# EAGLE design Controller Board v3 (EAGLE 5.06)
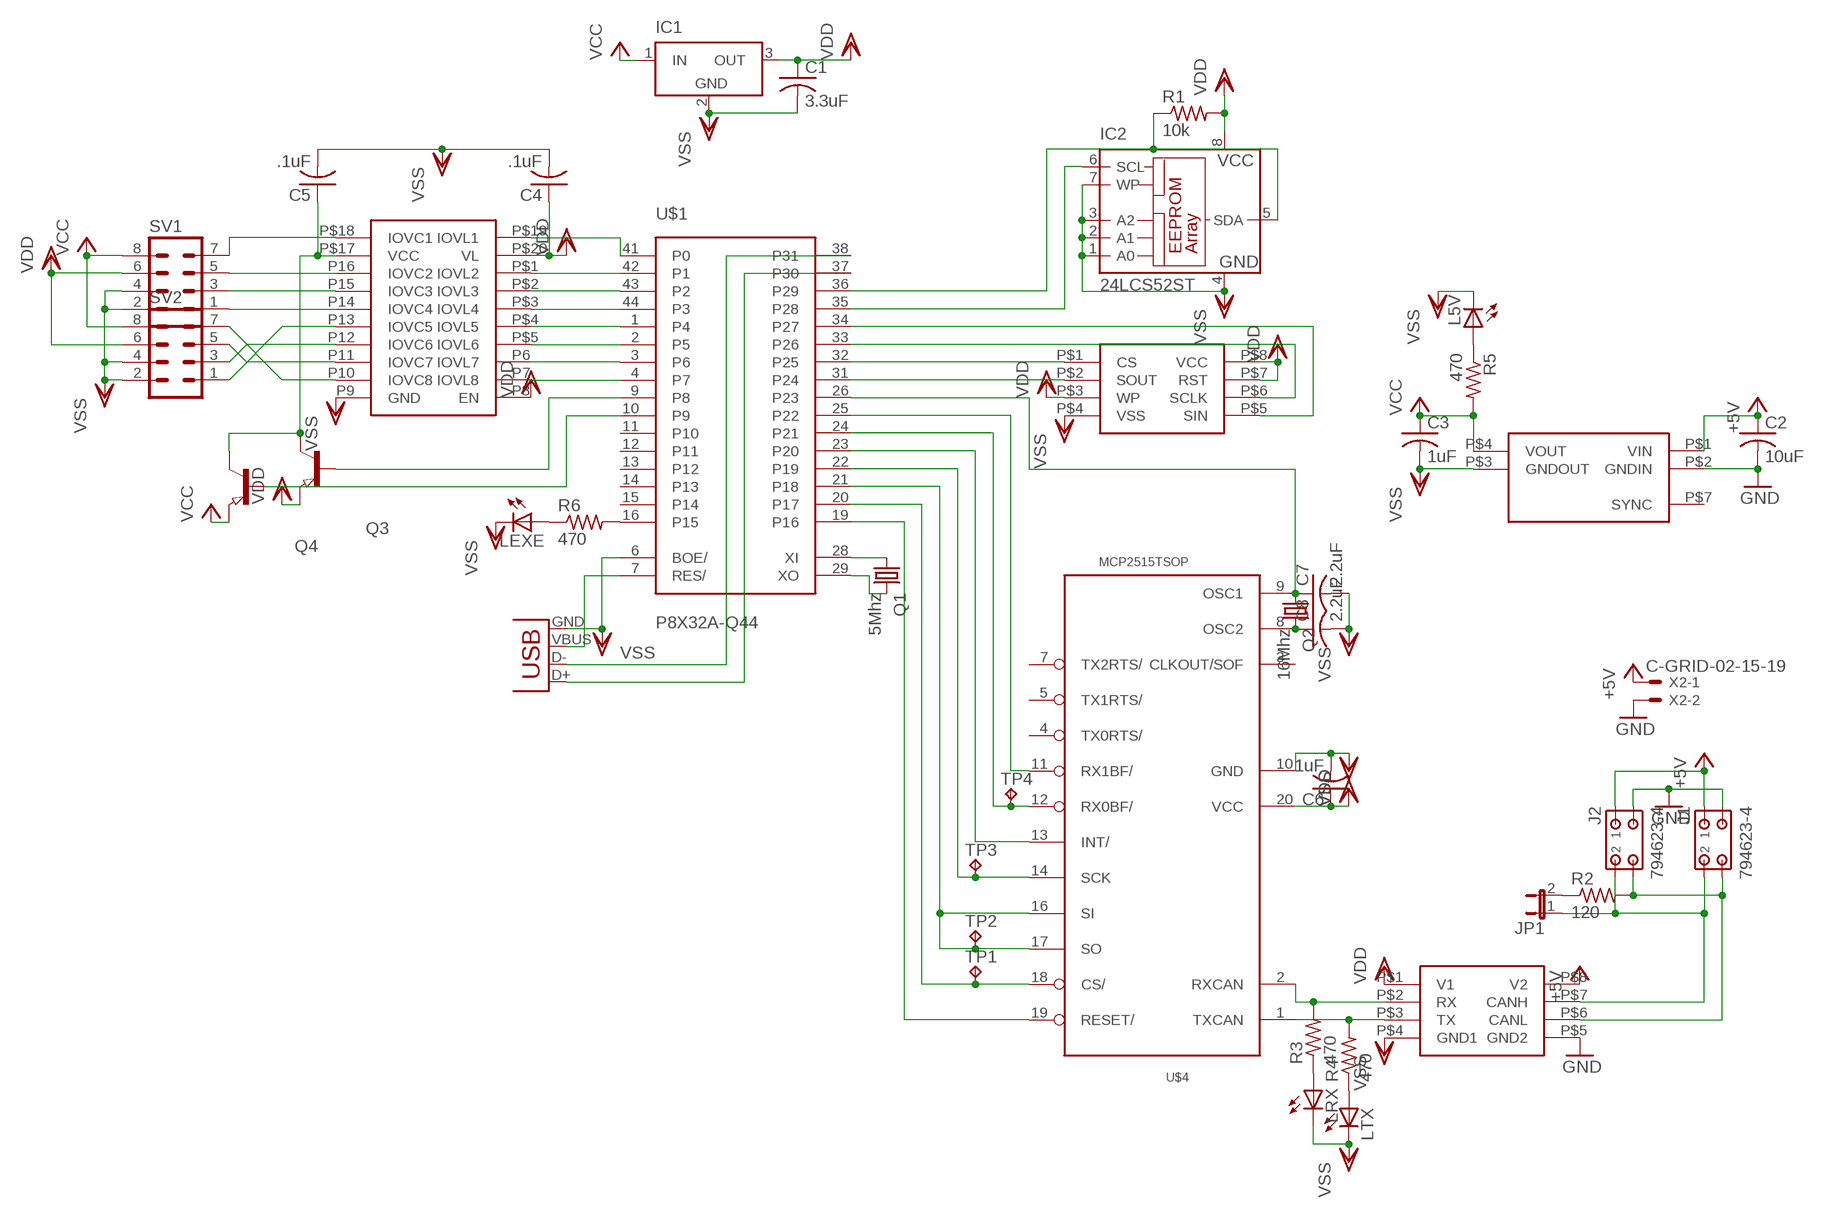
[diagram p0: schematic, sheet 1]

## Parts
C1  3.3uF  C-USC0805  [C0805]
C2  10uF  C-USC0805  [C0805]
C3  1uF  C-USC0805  [C0805]
C4  .1uF  C-USC0805  [C0805]
C5  .1uF  C-USC0805  [C0805]
C6  1uF  C-USC0805  [C0805]
C7  2.2uF  C-USC0805  [C0805]
C8  2.2uF  C-USC0805  [C0805]
IC1  LT1129CST5  [SOT223]
IC2  24LCS52ST  [TSSOP8]
J1  794623-4  [794623-4]
J2  794623-4  [794623-4]
JP1  JP1E  [JP1]
L5V  LEDCHIP-LED0805  [CHIP-LED0805]
LEXE  LEDCHIP-LED0805  [CHIP-LED0805]
LRX  LEDCHIP-LED0805  [CHIP-LED0805]
LTX  LEDCHIP-LED0805  [CHIP-LED0805]
Q1  5Mhz  CRYSTALHC49UP  [HC49UP]
Q2  16Mhz  CRYSTALHC49UP  [HC49UP]
Q3  PNP-TRANSISTOR_SOT23  [SOT23]
Q4  PNP-TRANSISTOR_SOT23  [SOT23]
R1  10k  R-US_R0603  [R0603]
R2  120  R-US_R0603  [R0603]
R3  470  R-US_R0603  [R0603]
R4  470  R-US_R0603  [R0603]
R5  470  R-US_R0603  [R0603]
R6  470  R-US_R0603  [R0603]
SV1  MA04-2  [MA04-2]
SV2  MA04-2  [MA04-2]
TP1  TPPAD1-13  [P1-13]
TP2  TPPAD1-13  [P1-13]
TP3  TPPAD1-13  [P1-13]
TP4  TPPAD1-13  [P1-13]
U$1  P8X32A-Q44  [P8X32A-Q44]
U$2  TI-DCP020505  [PDIP14-7]
U$3  TI-ISO1050  [DUB-8]
U$4  MCP2515TSOP  [TSSOP20]
U$5  M25PE20  [S08N]
U$6  MAX3000E  [TQFN-20]
X1  USBSMD  [USB-MINIB]
X2  C-GRID-02-15-19  [15-91-02]

## Nets
+5V: C2.1 J1.1 J2.1 U$2.P$1(VIN) U$3.P$8(V2) X2.1
GND: C2.2 J1.3 J2.3 U$2.P$2(GNDIN) U$3.P$5(GND2) X2.2
N$1: Q1.1 U$1.28(XI)
N$2: Q1.2 U$1.29(XO)
N$3: IC2.6(SCL) U$1.35(P28)
N$4: IC2.5(SDA) R1.1 U$1.36(P29)
N$5: U$1.7(RES/) X1.VBUS
N$6: U$1.38(P31) X1.D-
N$7: U$1.37(P30) X1.D+
N$8: U$1.25(P22) U$4.11(RX1BF/)
N$9: TP4.1(TP) U$1.24(P21) U$4.12(RX0BF/)
N$10: J1.4 J2.4 R2.2 U$3.P$6(CANL)
N$11: J1.2 J2.2 JP1.1 U$3.P$7(CANH)
N$12: U$1.33(P26) U$5.P$6(SCLK)
N$13: U$1.34(P27) U$5.P$5(SIN)
N$14: U$1.32(P25) U$5.P$1(CS)
N$15: U$1.31(P24) U$5.P$2(SOUT)
N$16: U$1.23(P20) U$4.13(INT/)
N$17: TP3.1(TP) U$1.22(P19) U$4.14(SCK)
N$18: C7.1 Q2.1 U$1.26(P23) U$4.9(OSC1)
N$19: C8.1 Q2.2 U$4.8(OSC2)
N$20: R3.2 U$3.P$2(RX) U$4.2(RXCAN)
N$21: R4.2 U$3.P$3(TX) U$4.1(TXCAN)
N$22: JP1.2 R2.1
N$23: TP2.1(TP) U$1.21(P18) U$4.16(SI) U$4.17(SO)
N$24: TP1.1(TP) U$1.20(P17) U$4.18(CS/)
N$25: U$1.19(P16) U$4.19(RESET/)
N$26: LRX.A R3.1
N$27: U$1.41(P0) U$6.P$19(IOVL1)
N$28: SV1.7 U$6.P$18(IOVC1)
N$29: SV1.5 U$6.P16(IOVC2)
N$30: U$1.42(P1) U$6.P$1(IOVL2)
N$31: U$1.43(P2) U$6.P$2(IOVL3)
N$32: U$1.44(P3) U$6.P$3(IOVL4)
N$33: U$1.1(P4) U$6.P$4(IOVL5)
N$34: U$1.2(P5) U$6.P$5(IOVL6)
N$35: U$1.3(P6) U$6.P6(IOVL7)
N$36: U$1.4(P7) U$6.P7(IOVL8)
N$37: SV1.3 U$6.P15(IOVC3)
N$38: SV1.1 U$6.P14(IOVC4)
N$39: SV2.1 U$6.P13(IOVC5)
N$40: SV2.7 U$6.P10(IOVC8)
N$41: SV2.3 U$6.P12(IOVC6)
N$42: SV2.5 U$6.P11(IOVC7)
N$43: Q3.1(B) U$1.9(P8)
N$44: Q4.1(B) U$1.10(P9)
N$45: C5.1 Q3.3(C) Q4.3(C) U$6.P$17(VCC)
N$46: LTX.A R4.1
N$47: L5V.A R5.1
N$48: LEXE.A R6.1
N$49: R6.2 U$1.16(P15)
VCC: C3.1 IC1.1(IN) Q4.2(E) R5.2 SV1.8 SV2.8 U$2.P$4(VOUT)
VDD: C1.1 C4.1 C6.1 IC1.3(OUT) IC2.8(VCC) Q3.2(E) R1.2 SV1.6 SV2.6 U$3.P$1(V1) U$4.20(VCC) U$5.P$3(WP) U$5.P$7(RST) U$5.P$8(VCC) U$6.P8(EN) U$6.P$20(VL)
VSS: C1.2 C3.2 C4.2 C5.2 C6.2 C7.2 C8.2 IC1.2(GND) IC2.1(A0) IC2.2(A1) IC2.3(A2) IC2.4(GND) IC2.7(WP) L5V.C LEXE.C LRX.C LTX.C SV1.2 SV1.4 SV2.2 SV2.4 U$1.6(BOE/) U$2.P$3(GNDOUT) U$3.P$4(GND1) U$4.10(GND) U$5.P$4(VSS) U$6.P9(GND) X1.GND
Unconnected: U$1.11(P10) U$1.12(P11) U$1.13(P12) U$1.14(P13) U$1.15(P14) U$2.P$7(SYNC) U$4.3(CLKOUT/SOF) U$4.4(TX0RTS/) U$4.5(TX1RTS/) U$4.7(TX2RTS/)

## Power pins joined to a net without a drawn wire
VDD: U$1.8(VDD) U$1.18(VDD) U$1.30(VDD) U$1.40(VDD)
VSS: IC1.4(GND) U$1.5(VSS) U$1.17(VSS) U$1.27(VSS) U$1.39(VSS)

## Library data of the parts
C1-C8 = rcl:C-US: CAPACITOR, American symbol
IC1 = linear-technology:LT1129CST5: VOLTAGE REGULATOR with shutdown
IC2 = microchip:24*: Serial EEPROM I2C
J1 J2 = con-amp:794623-4: MICRO MATE N LOK Dual Row, grid 1.5 mm Source: http://catalog.tycoelectronics.com .. ENG_CD_794623_F.pdf
JP1 = jumper:JP1E: JUMPER
L5V LEXE LRX LTX = led:LED: LED OSRAM: - CHIPLED LG R971, LG N971, LY N971, LG Q971, LY Q971, LO R971, LY R971 LH N974, LH R974 LS Q976, LO Q976, LY Q976 LO Q996 - Hyper CHIPLED LW Q18S LB Q993, LB Q99A, LB R99A - SideLED LS A670, LO A670, LY A670, LG A670, LP A670 LB A673, LV A673, LT A673, LW A673 LH A674 LY A675 LS A676, LA A676, LO A676, LY A676, LW A676 LS A679, LY A679, LG A679 - Hyper Micro SIDELED® LS Y876, LA Y876, LO Y876, LY Y876 LT Y87S - SmartLED LW L88C, LW L88S LB L89C, LB L89S, LG L890 LS L89K, LO L89K, LY L89K LS L896, LA L896, LO L896, LY L896 - TOPLED LS T670, LO T670, LY T670, LG T670, LP T670 LSG T670, LSP T670, LSY T670, LOP T670, LYG T670 LG T671, LOG T671, LSG T671 LB T673, LV T673, LT T673, LW T673 LH T674 LS T676, LA T676, LO T676, LY T676, LB T676, LH T676, LSB T676, LW T676 LB T67C, LV T67C, LT T67C, LS T67K, LO T67K, LY T67K, LW E67C LS E67B, LA E67B, LO E67B, LY E67B, LB E67C, LV E67C, LT E67C LW T67C LS T679, LY T679, LG T679 LS T770, LO T770, LY T770, LG T770, LP T770 LB T773, LV T773, LT T773, LW T773 LH T774 LS E675, LA E675, LY E675, LS T675 LS T776, LA T776, LO T776, LY T776, LB T776 LHGB T686 LT T68C, LB T68C - Hyper Mini TOPLED® LB M676 - Mini TOPLED Santana® LG M470 LS M47K, LO M47K, LY M47K Source: http://www.osram.convergy.de LUXEON: - LUMILED® LXK2-PW12-R00, LXK2-PW12-S00, LXK2-PW14-U00, LXK2-PW14-V00 LXK2-PM12-R00, LXK2-PM12-S00, LXK2-PM14-U00 LXK2-PE12-Q00, LXK2-PE12-R00, LXK2-PE12-S00, LXK2-PE14-T00, LXK2-PE14-U00 LXK2-PB12-K00, LXK2-PB12-L00, LXK2-PB12-M00, LXK2-PB14-N00, LXK2-PB14-P00, LXK2-PB14-Q00 LXK2-PR12-L00, LXK2-PR12-M00, LXK2-PR14-Q00, LXK2-PR14-R00 LXK2-PD12-Q00, LXK2-PD12-R00, LXK2-PD12-S00 LXK2-PH12-R00, LXK2-PH12-S00 LXK2-PL12-P00, LXK2-PL12-Q00, LXK2-PL12-R00 Source: www.luxeon.com KINGBRIGHT: KA-3528ASYC Source: www.kingbright.com
Q1 Q2 = crystal:CRYSTAL: CRYSTAL
Q3 Q4 = semicon-smd-ipc:PNP-TRANSISTOR_: PNP TRANSISTOR
R1-R6 = rcl:R-US_: RESISTOR, American symbol
SV1 SV2 = con-lstb:MA04-2: PIN HEADER
TP1-TP4 = testpad:TP: Test pad
U$1 = parallax_propeller:P8X32A-Q44
U$2 = isodcdc:TI-DCP020505
U$3 = isodcdc:TI-ISO1050
U$4 = MCP2515_MT:MCP2515*: MCP2515 Standalone CAN-Controller by Microchip Eagle-Lib. by MartinThomas
U$5 = Flash:M25PE20
U$6 = Level Shifters:MAX3000E
X1 = SparkFun:USB: USB Connectors USB-B-PTH is fully proven SKU : PRT-00139 USB-miniB is fully proven SKU : PRT-00587 USB-A-PCB is untested. USB-A-H is throughly reviewed, but untested. Spark Fun Electronics SKU : PRT-00437 USB-B-SMT is throughly reviewed, but untested. Needs silkscreen touching up. USB-A-S has not been used/tested USB-MB-H has not been used/tested
X2 = con-molex:C-GRID-02: CONNECTOR wire to board 2.54 mm (0.100") pitch header

## Board
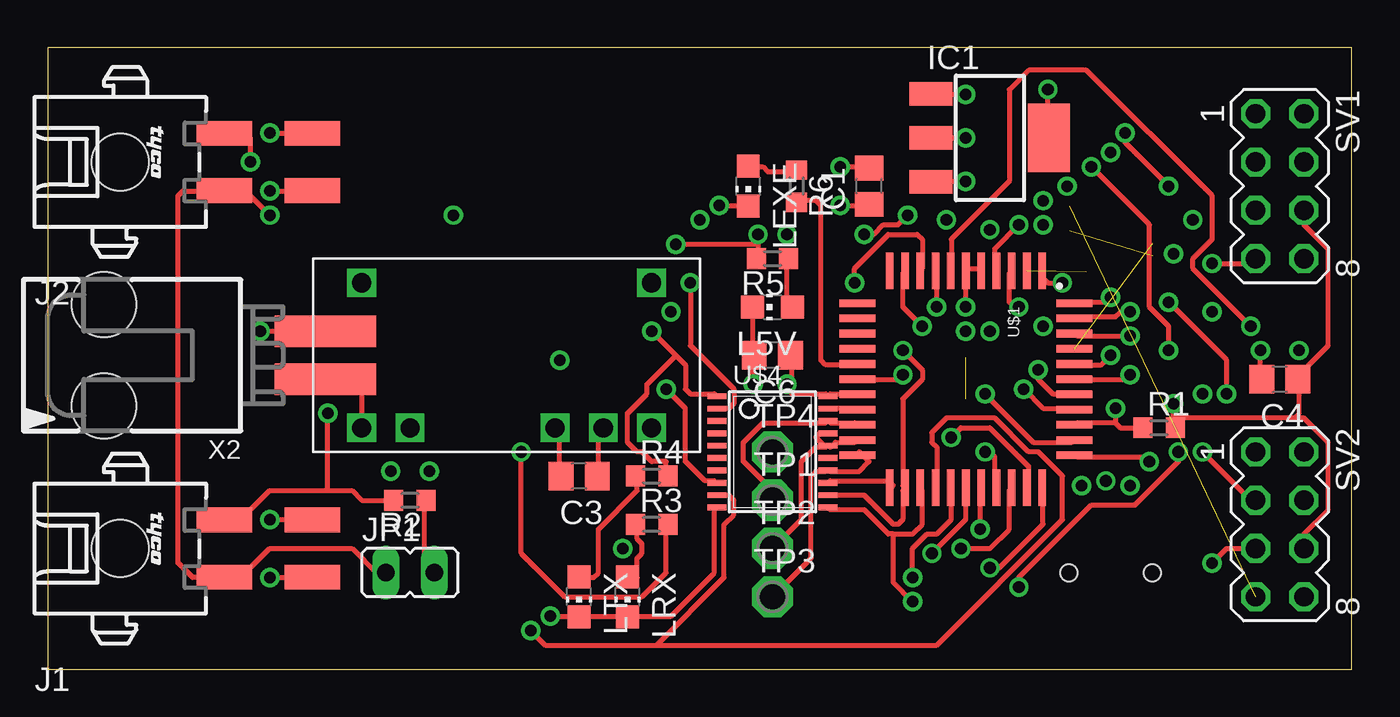
[diagram p1: board, top side]
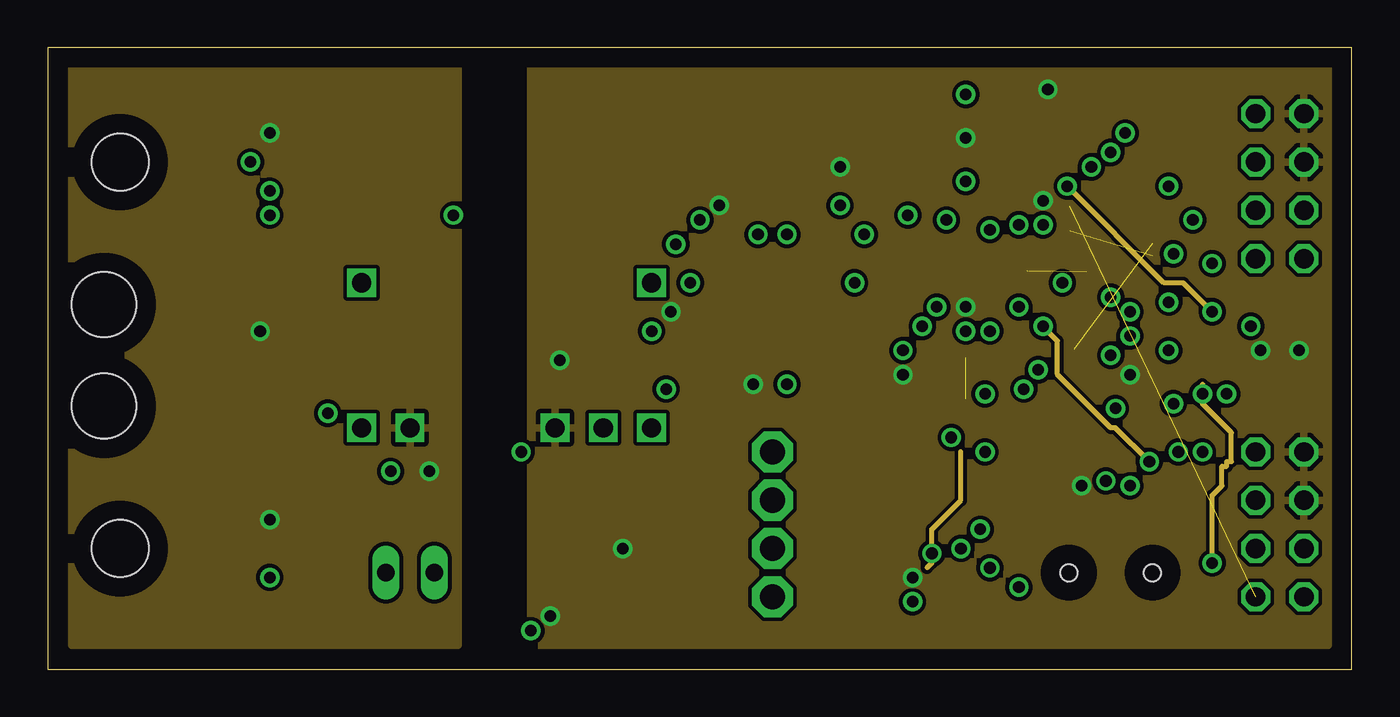
[diagram p2: board, inner layer Route2]
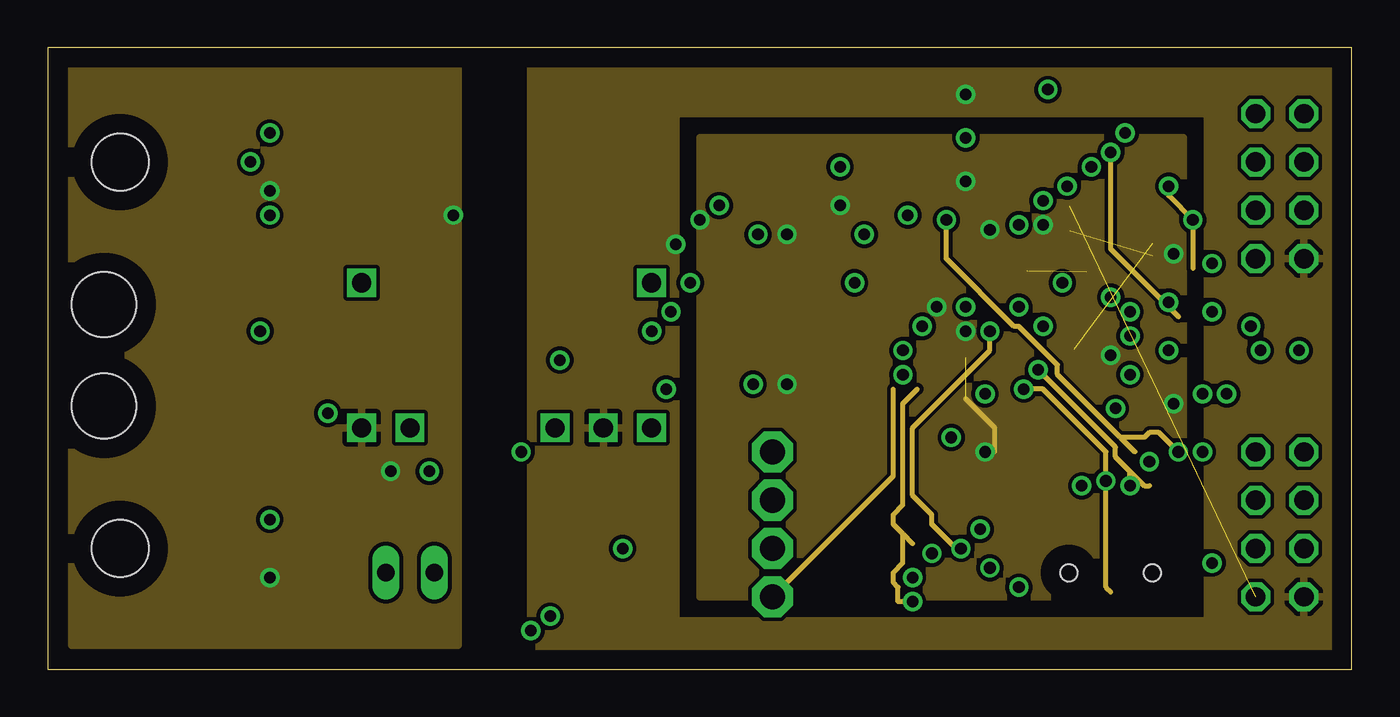
[diagram p3: board, inner layer Route15]
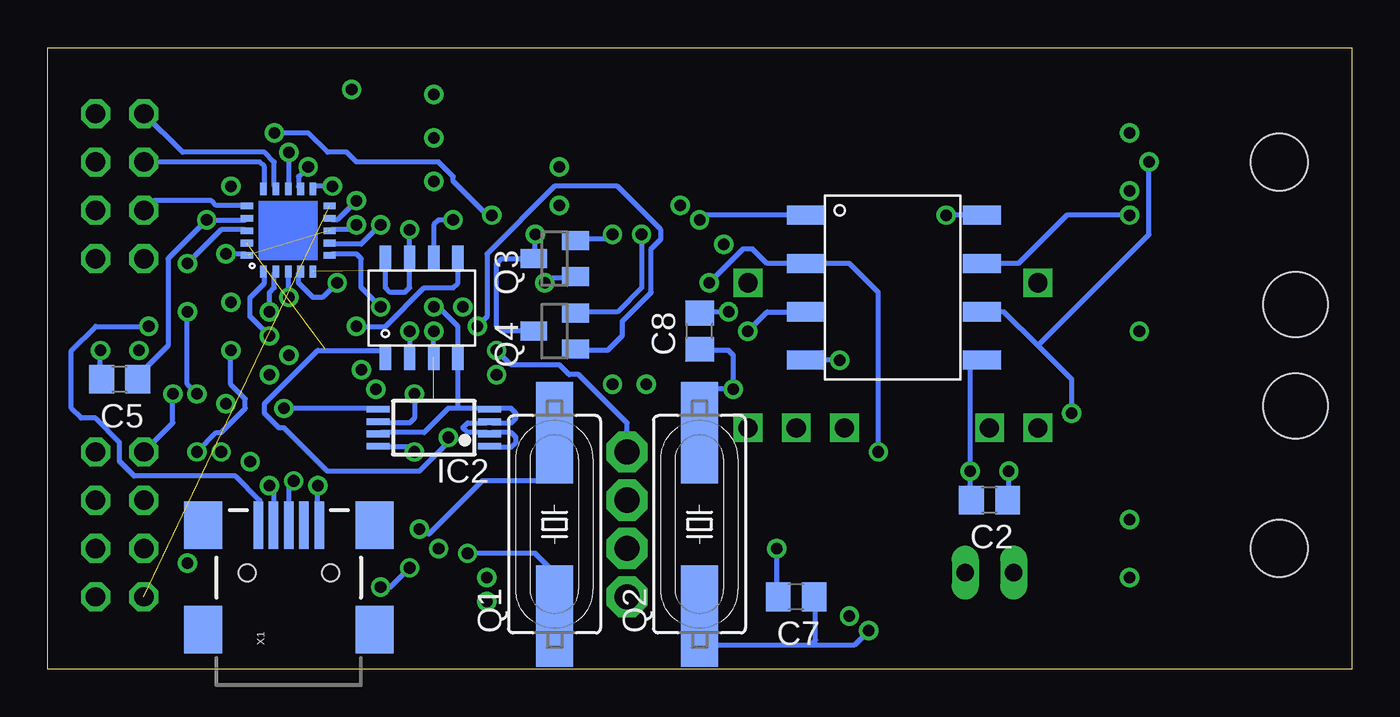
[diagram p4: board, bottom side, seen from below]

Size 68.56 x 32.69 mm. Coordinates in mm from the lower left corner, seen from the top.
Outline: 0,0 68.56,0 68.56,32.69 0,32.69 0,0
Copper layers (1*2+15*16): Top 0.035mm / dielectric 0.2mm / Route2 0.035mm / dielectric 1.5mm / Route15 0.035mm / dielectric 0.2mm / Bottom 0.035mm
Design rules "4 layer": minimum track width 10mil, minimum drill 24mil, track to track 8mil, track to pad 8mil, pad to pad 8mil, via to via 8mil, smd to smd 8mil, copper to edge 40mil, drill to drill 8mil, minimum pad ring 10mil, minimum via ring 8mil, stop-mask expansion 4mil, vias tented up to drill 0mil, thermal gap 10mil
tRestrict: area 22.9,3.8 to 24.1,30.5

### Footprints (pad centres in the part's own frame; a part is rotated, then mirrored left to right if it is on the bottom)
C0805 = smd 1.3 x 1.5: 1 -0.95,0; 2 0.95,0
SOT223 = smd 1.219 x 2.235: 1 -2.311,-3.099; 2 0,-3.099; 3 2.311,-3.099 | smd 3.6 x 2.2: 4 0,3.099
TSSOP8 = smd 0.35 x 1.2: 1 -0.975,-2.925; 2 -0.325,-2.925; 3 0.325,-2.925; 4 0.975,-2.925; 5 0.975,2.925; 6 0.325,2.925; 7 -0.325,2.925; 8 -0.975,2.925
794623-4 = smd 1.3 x 2.92: 1 1.5,10.1; 2 1.5,5.48; 3 -1.5,10.1; 4 -1.5,5.48 | hole 3: 0,0
JP1 = drill 0.914 long: 1 0,-1.27; 2 0,1.27
CHIP-LED0805 = smd 1.2 x 1.2: A 0,-1.05; C 0,1.05
HC49UP = smd 5.334 x 1.93: 1 -4.826,0; 2 4.826,0
SOT23 = smd 1 x 1.4: 1 -0.95,-1.1; 2 0.95,-1.1; 3 0,1.1
R0603 = smd 1 x 1.1: 1 -0.85,0; 2 0.85,0
MA04-2 = drill 1.016 octagon: 1 -3.81,-1.27; 2 -3.81,1.27; 3 -1.27,-1.27; 4 -1.27,1.27; 5 1.27,-1.27; 6 1.27,1.27; 7 3.81,-1.27; 8 3.81,1.27
P1-13 = drill 1.321 pad 2.159 octagon: 1 0,0
P8X32A-Q44 = smd 1.9 x 0.4: 1 -5.713,4.013; 2 -5.713,3.212; 3 -5.713,2.413; 4 -5.713,1.613; 5 -5.713,0.812; 6 -5.713,0.013; 7 -5.713,-0.787; 8 -5.713,-1.587; 9 -5.713,-2.388; 10 -5.713,-3.188; 11 -5.713,-3.987; 23 5.688,-3.987; 24 5.688,-3.188; 25 5.688,-2.388; 26 5.688,-1.587; 27 5.688,-0.787; 28 5.688,0.013; 29 5.688,0.812; 30 5.688,1.613; 31 5.688,2.413; 32 5.688,3.212; 33 5.688,4.013 | smd 0.4 x 1.9: 12 -4.013,-5.688; 13 -3.212,-5.688; 14 -2.413,-5.688; 15 -1.613,-5.688; 16 -0.812,-5.688; 17 -0.013,-5.688; 18 0.787,-5.688; 19 1.587,-5.688; 20 2.388,-5.688; 21 3.188,-5.688; 22 3.987,-5.688; 34 3.987,5.713; 35 3.188,5.713; 36 2.388,5.713; 37 1.587,5.713; 38 0.787,5.713; 39 -0.013,5.713; 40 -0.812,5.713; 41 -1.613,5.713; 42 -2.413,5.713; 43 -3.212,5.713; 44 -4.013,5.713
PDIP14-7 = drill 1 square: P$1 -8.89,-3.81; P$2 -6.35,-3.81; P$3 1.27,-3.81; P$4 3.81,-3.81; P$5 6.35,-3.81; P$6 6.35,3.81; P$7 -8.89,3.81
DUB-8 = smd 2 x 1: P$1 -4.572,3.556; P$2 -4.572,1.016; P$3 -4.572,-1.524; P$4 -4.572,-4.064; P$5 4.678,-4.064; P$6 4.678,-1.524; P$7 4.678,1.016; P$8 4.678,3.556
TSSOP20 = smd 0.305 x 0.991: 1 -2.925,-2.918; 2 -2.275,-2.918; 3 -1.625,-2.918; 4 -0.975,-2.918; 5 -0.325,-2.918; 6 0.325,-2.918; 7 0.975,-2.918; 8 1.625,-2.918; 9 2.275,-2.918; 10 2.925,-2.918; 11 2.925,2.918; 12 2.275,2.918; 13 1.625,2.918; 14 0.975,2.918; 15 0.325,2.918; 16 -0.325,2.918; 17 -0.975,2.918; 18 -1.625,2.918; 19 -2.275,2.918; 20 -2.925,2.918
S08N = smd 0.6 x 1.3: P$1 -2.54,-2.667; P$2 -1.27,-2.667; P$3 0,-2.667; P$4 1.27,-2.667; P$5 1.27,2.587; P$6 0,2.587; P$7 -1.27,2.587; P$8 -2.54,2.587
TQFN-20 = smd 0.65 x 0.35: P6 0.875,-1.1; P7 0.875,-0.45; P8 0.875,0.2; P9 0.875,0.85; P10 0.875,1.5; P16 -3.475,1.5; P$17 -3.475,0.85; P$18 -3.475,0.2; P$19 -3.475,-0.45; P$20 -3.475,-1.1 | smd 0.35 x 0.65: P11 0,2.4; P12 -0.65,2.4; P13 -1.3,2.4; P14 -1.95,2.4; P15 -2.6,2.4; P$1 -2.6,-1.95; P$2 -1.95,-1.95; P$3 -1.3,-1.95; P$4 -0.65,-1.95; P$5 0,-1.95
USB-MINIB = smd 2.5 x 0.5: D+ 2.5,0; D- 2.5,0.8; GND 2.5,-1.6; ID 2.5,-0.8; VBUS 2.5,1.6 | smd 2.5 x 2: GND@1 -3,-4.5; GND@2 -3,4.5; GND@3 2.5,4.5; GND@4 2.5,-4.5 | hole 0.9: 0,2.2; 0,-2.2
15-91-02 = smd 1.651 x 5.334: 1 -1.27,-10.795; 2 1.27,-10.795 | hole 3.404: -2.667,0.838; 2.667,0.838

### Placement (x,y rotation side)
C1  43.18,25.4 90 top
C2  19.05,8.89 180 bottom
C3  27.94,10.16 180 top
C4  64.77,15.24 180 top
C5  64.77,15.24 180 bottom
C6  38.1,16.51 180 top
C7  29.21,3.81 180 bottom
C8  34.29,17.78 90 bottom
IC1  49.53,27.94 270 top
IC2  48.26,12.7 90 bottom
J1  3.81,6.35 270 top
J2  3.81,26.67 270 top
JP1  19.05,5.08 270 top
L5V  38.1,19.05 90 top
LEXE  36.83,25.4 180 top
LRX  30.48,3.81 180 top
LTX  27.94,3.81 180 top
Q1  41.91,7.62 90 bottom
Q2  34.29,7.62 90 bottom
Q3  41.91,21.59 90 bottom
Q4  41.91,17.78 90 bottom
R1  58.42,12.7 0 top
R2  19.05,8.89 180 top
R3  31.75,7.62 0 top
R4  31.75,10.16 0 top
R5  38.1,21.59 180 top
R6  39.37,25.4 270 top
SV1  64.77,25.4 270 top
SV2  64.77,7.62 270 top
TP1  38.1,8.89 0 top
TP2  38.1,6.35 0 top
TP3  38.1,3.81 0 top
TP4  38.1,11.43 0 top
U$1  48.26,15.24 270 top
U$2  25.4,16.51 0 top
U$3  24.13,20.32 0 bottom
U$4  38.1,11.43 270 top
U$5  48.26,19.05 0 bottom
U$6  54.61,22.86 0 bottom
X1  55.88,5.08 90 bottom
X2  3.81,16.51 90 top

### Tracks (layer width: path | path; a pad name or v marks a point on that pad's centre or on a via)
+5V  (via drill 0.61)
  Top 0.254: v11.68,4.83 13.72,4.83 J1.1 | v11.68,25.15 13.72,25.15 J2.1 | U$2.P$1 16.51,14.99 16.26,15.24 X2.1
  Bottom 0.254: v18.03,10.41 18.03,8.89 C2.1 | U$3.P$8 v21.34,23.88
  pour Route15: 1.27,31.75 1.27,1.27 21.59,1.27 21.59,31.75
GND  (via drill 0.61)
  Top 0.254: v11.68,7.87 13.72,7.87 J1.3 | v11.68,28.19 13.72,28.19 J2.3 | v11.18,17.78 X2.2
  Bottom 0.254: C2.2 20.07,8.89 v20.07,10.41 20.07,16.26 U$3.P$5
  pour Route2: 21.59,31.75 21.59,1.27 1.27,1.27 1.27,31.75
N$1  (via drill 0.61)
  Top 0.254: v46.48,6.1 48.26,7.87 48.26,9.4 U$1.28
  Route2 0.254: 48.01,11.43 48.01,8.89 46.48,7.37 v46.48,6.1 46.48,5.59 46.23,5.33
  Bottom 0.254: v46.48,6.1 42.93,6.1 41.91,5.08 Q1.1
N$2  (via drill 0.61)
  Top 0.254: v49.02,7.37 49.02,9.4 U$1.29
  Bottom 0.254: v49.02,7.37 48.77,7.11 48.51,7.11 45.72,9.91 42.16,9.91 41.91,10.16 Q1.2
N$3  (via drill 0.61)
  Top 0.254: v49.28,14.48 51.82,11.94 53.85,11.94 U$1.35
  Bottom 0.254: v49.28,14.48 49.28,13.21 49.53,12.95 51.05,12.95 IC2.6
N$4  (via drill 0.61)
  Top 0.254: 56.13,12.95 56.39,12.7 R1.1 | 56.13,12.95 54.1,12.95 U$1.36 | v56.13,13.72 56.13,12.95
  Bottom 0.254: v56.13,13.72 51.31,13.72 IC2.5
N$5  (via drill 0.61)
  Top 0.254: v63.25,18.03 60.2,21.08 60.2,21.59 61.21,22.61 61.21,24.89 54.61,31.5 51.56,31.5 50.55,30.48 50.55,25.65 47.5,22.61 47.5,21.08 U$1.7
  Bottom 0.254: v63.25,18.03 66.04,18.03 67.31,16.76 67.31,13.72 66.8,13.21 66.04,13.21 64.77,11.94 64.77,10.92 64.01,10.16 58.67,10.16 57.4,8.89 57.4,7.62 X1.VBUS
N$6  (via drill 0.61)
  Top 0.254: v52.07,15.75 52.07,15.24 52.83,14.48 53.85,14.48 U$1.38
  Route15 0.254: v52.07,15.75 56.13,11.68 56.13,11.18 56.9,10.41 | 56.9,10.41 57.66,9.65 57.91,9.65 | v56.9,9.65 56.9,10.41
  Bottom 0.254: v56.9,9.65 56.64,9.4 56.64,7.62 X1.D-
N$7  (via drill 0.61)
  Top 0.254: v51.31,14.73 52.32,13.72 53.85,13.72 U$1.37
  Route15 0.254: v51.31,14.73 52.32,14.73 55.63,11.43 v55.63,9.91 55.63,4.32 55.88,4.06
  Bottom 0.254: v55.63,9.91 55.88,9.65 X1.D+
N$8  (via drill 0.61)
  Top 0.254: 44.45,7.11 44.2,7.11 42.93,8.38 41.15,8.38 U$4.11 | 44.45,7.11 45.47,7.11 45.97,7.62 45.97,9.4 U$1.25 | v45.47,3.56 44.45,4.57 44.45,7.11
  Route15 0.254: 45.72,14.73 44.96,13.97 44.96,8.64 44.45,8.13 44.45,7.62 44.96,7.11 | 44.96,7.11 45.47,6.6 | 44.96,7.11 44.96,5.59 44.45,5.08 44.45,4.57 44.7,4.32 44.7,3.56 v45.47,3.56
N$9  (via drill 0.61)
  Top 0.254: U$4.12 41.15,9.14 42.93,9.14 44.45,7.62 44.7,7.62 44.96,7.87 44.96,9.4 U$1.24 44.96,9.65 44.96,14.22 45.97,15.24 45.97,15.75 v44.96,16.76
  Bottom 0.254: v44.96,16.76 44.2,16 41.66,16 41.15,15.49 40.64,15.49 38.1,12.95 TP4.1
N$10  (via drill 0.61)
  Top 0.254: 14.73,9.4 11.68,9.4 10.16,7.87 9.4,7.87 J1.4 | 14.73,9.4 16,9.4 16.51,8.89 R2.2 | 14.73,9.4 v14.73,13.46 | v10.67,26.67 10.67,27.94 10.41,28.19 9.4,28.19 J2.4
  Bottom 0.254: 16.51,17.02 14.73,15.24 v14.73,13.46 | 16.51,17.02 18.29,18.8 U$3.P$6 | v10.67,26.67 10.67,22.86 16.51,17.02
N$11  (via drill 0.61)
  Top 0.254: JP1.1 17.27,5.08 16,6.35 11.68,6.35 10.16,4.83 9.4,4.83 J1.2 9.14,4.83 7.62,4.83 6.86,5.59 6.86,24.89 7.11,25.15 9.14,25.15 J2.2 9.4,25.15 10.41,25.15 v11.68,23.88
  Bottom 0.254: v11.68,23.88 14.99,23.88 17.53,21.34 U$3.P$7
N$12  (via drill 0.61)
  Top 0.254: v49.53,5.33 50.04,5.33 52.32,7.62 52.32,9.4 U$1.33 | v51.05,4.32 51.05,4.83 54.86,8.64 57.15,8.64 59.44,10.92 v59.44,11.43
  Route15 0.254: 56.39,12.19 53.09,15.49 53.09,16 51.05,18.03 50.8,18.03 47.24,21.59 v47.24,23.62 47.24,23.88 | 56.39,12.19 57.15,11.43 | v59.44,11.43 59.44,11.68 59.18,11.68 58.42,12.45 57.91,12.45 57.66,12.19 56.39,12.19
  Bottom 0.254: v47.24,23.62 48.01,23.62 48.26,23.37 U$5.P$6 | v49.53,5.33 50.55,4.32 v51.05,4.32
N$13  (via drill 0.61)
  Top 0.254: v57.91,10.92 57.66,11.18 54.1,11.18 U$1.34
  Route2 0.254: v57.91,10.92 56.13,12.7 55.88,12.7 53.09,15.49 53.09,17.27 v52.32,18.03
  Bottom 0.254: v52.32,18.03 50.8,18.03 48.77,20.07 47.24,20.07 46.99,20.32 U$5.P$5
N$14  (via drill 0.61)
  Top 0.254: v47.5,12.19 48.01,12.7 49.53,12.7 51.56,10.67 51.56,9.65 U$1.32
  Bottom 0.254: v47.5,12.19 47.5,11.94 49.02,10.41 53.85,10.41 56.13,12.7 56.39,12.7 57.15,13.46 57.15,13.97 54.36,16.76 50.8,16.76 U$5.P$1
N$15  (via drill 0.61)
  Top 0.254: v48.01,6.35 49.53,6.35 50.55,7.37 50.55,9.4 U$1.31
  Route15 0.254: v49.53,17.78 49.53,16.76 45.47,12.7 45.47,9.14 46.48,8.13 46.48,7.62 47.75,6.35 v48.01,6.35
  Bottom 0.254: v49.53,17.78 U$5.P$2
N$16
  Top 0.254: U$4.13 41.15,9.91 44.2,9.91 44.45,9.65 U$1.23
N$17
  Top 0.254: U$1.22 42.67,11.43 43.18,10.92 42.67,10.41 41.15,10.41 U$4.14 40.89,10.41 40.39,10.41 40.13,10.16 40.13,5.84 TP3.1
  Route15 0.254: 44.45,14.73 44.45,10.16 TP3.1
N$18  (via drill 0.61)
  Top 0.254: 32,1.27 35.56,4.83 35.56,7.62 36.07,8.13 36.07,8.89 35.81,9.14 35.31,9.14 U$4.9 | 32,1.27 26.16,1.27 v25.4,2.03 | 32,1.27 46.74,1.27 53.34,7.87 53.34,10.16 52.07,11.43 51.56,11.43 49.78,13.21 47.24,13.21 46.48,12.45 46.48,11.94 46.74,11.68 46.74,9.65 U$1.26
  Bottom 0.254: 28.45,1.27 28.19,1.52 28.19,3.81 C7.1 | 28.45,1.27 34.29,1.27 Q2.1 | v25.4,2.03 26.16,1.27 28.45,1.27
N$19  (via drill 0.61)
  Top 0.254: v32.51,14.73 33.53,13.72 33.53,10.92 34.54,9.91 35.05,9.91 U$4.8
  Bottom 0.254: Q2.2 34.29,14.48 34.04,14.73 v32.51,14.73 32.51,16.51 32.77,16.76 34.29,16.76 C8.1
N$20  (via drill 0.61)
  Top 0.254: v33.78,20.32 33.78,17.02 36.07,14.73 36.07,13.97 35.81,13.72 35.31,13.72 U$4.2 | v24.89,11.43 24.89,6.1 27.18,3.81 31.24,3.81 32.51,5.08 32.51,7.62 R3.2
  Bottom 0.254: v33.78,20.32 32,22.1 31.5,22.1 30.73,21.34 U$3.P$2 26.42,21.34 24.89,19.81 v24.89,11.43
N$21  (via drill 0.61)
  Top 0.254: 33.02,16.51 v31.75,17.78 | 33.02,16.51 33.53,16 33.53,14.73 33.78,14.48 35.05,14.48 U$4.1 | 33.02,16.51 31.5,14.99 31.5,14.48 30.48,13.46 30.48,11.94 30.99,11.43 31.24,11.43 31.75,10.92 32.51,10.92 32.51,10.16 R4.2
  Bottom 0.254: v31.75,17.78 30.73,18.8 U$3.P$3
N$22
  Top 0.254: JP1.2 19.81,5.59 19.81,8.89 R2.1
N$23
  Top 0.254: 40.89,11.68 40.39,12.19 40.64,12.45 40.89,12.45 U$4.17 | U$1.21 42.42,11.94 41.4,11.94 41.15,11.68 U$4.16 40.89,11.68 | 40.89,11.68 40.39,11.68 39.62,10.92 39.62,7.87 TP2.1
N$24
  Top 0.254: U$1.20 42.42,12.95 41.15,12.95 U$4.18 40.89,12.95 37.59,12.95 36.58,11.94 36.58,10.92 38.1,9.4 TP1.1
N$25
  Top 0.254: U$4.19 41.15,13.72 42.42,13.72 U$1.19
N$26
  Top 0.254: R3.1 30.99,7.62 30.99,6.86 31.24,6.6 31.24,6.1 30.99,5.84 30.99,4.83 30.48,4.83 LRX.A
N$27  (1 unrouted)
N$28  (via drill 0.61)
  Top 0.254: v61.21,21.34 63.25,21.34 SV1.7
  Bottom 0.254: v61.21,21.34 59.44,23.11 58.17,23.11 U$6.P$18
N$29
  Bottom 0.254: SV1.5 62.99,24.64 59.94,24.64 59.69,24.38 58.17,24.38 U$6.P16
N$30  (via drill 0.61)
  Top 0.254: v56.9,17.53 54.1,17.53 U$1.42
  Bottom 0.254: v56.9,17.53 57.91,18.54 57.91,19.56 57.15,20.32 57.15,20.83 U$6.P$1
N$31  (via drill 0.61)
  Top 0.254: v56.9,18.8 56.39,18.8 56.13,18.54 54.1,18.54 U$1.43
  Bottom 0.254: v56.9,18.8 56.9,19.81 56.64,20.07 56.64,20.83 U$6.P$2
N$32  (via drill 0.61)
  Top 0.254: v55.88,19.56 55.63,19.3 54.1,19.3 U$1.44
  Bottom 0.254: v55.88,19.56 55.88,20.83 U$6.P$3
N$33  (via drill 0.61)
  Top 0.254: v53.34,20.32 52.58,20.32 52.32,20.57 52.32,20.83 U$1.1
  Bottom 0.254: v53.34,20.32 54.1,19.56 54.61,19.56 55.37,20.32 55.37,20.83 U$6.P$4
N$34  (1 unrouted)
N$35  (via drill 0.61)
  Top 0.254: v51.05,19.05 50.8,19.05 50.55,19.3 50.55,20.83 U$1.3
  Bottom 0.254: v51.05,19.05 52.07,20.07 52.07,21.59 52.32,21.84 53.59,21.84 U$6.P6
N$36  (via drill 0.61)
  Top 0.254: v51.05,23.37 49.78,22.1 49.78,21.08 U$1.4
  Bottom 0.254: v51.05,23.37 52.07,22.35 53.59,22.35 U$6.P7
N$37
  Bottom 0.254: SV1.3 57.4,26.67 57.15,26.42 57.15,25.4 U$6.P15
N$38
  Bottom 0.254: SV1.1 61.47,27.18 57.15,27.18 56.64,26.67 56.64,25.4 U$6.P14
N$39  (via drill 0.61)
  Top 0.254: v58.93,19.3 61.98,16.26 v61.98,14.48
  Route15 0.254: v55.88,27.18 55.88,22.1 58.67,19.3 | 58.67,19.3 59.44,18.54 | v58.93,19.3 58.67,19.3
  Bottom 0.254: v55.88,27.18 55.88,25.4 U$6.P13 | v61.98,14.48 61.98,12.95 SV2.1
N$40  (1 unrouted)
N$41  (via drill 0.61)
  Top 0.254: v54.86,26.42 57.91,23.37 57.91,19.05 58.93,18.03 v58.93,16.76 | v60.71,11.43 63.25,8.89 SV2.3
  Bottom 0.254: v54.86,26.42 55.37,25.91 55.37,25.4 U$6.P12 | v58.93,16.76 58.93,14.99 58.17,14.22 58.17,13.72 59.44,12.45 59.69,12.45 v60.71,11.43
N$42  (via drill 0.61)
  Top 0.254: SV2.5 61.98,6.35 v61.21,5.59
  Route2 0.254: 60.71,14.99 v60.71,14.48 60.71,13.97 62.23,12.45 62.23,10.92 61.98,10.92 61.98,10.67 61.72,10.67 61.72,9.65 61.21,9.14 v61.21,5.59 | v53.59,25.4 58.67,20.32 59.69,20.32 v61.21,18.8
  Bottom 0.254: v53.59,25.4 54.61,25.4 U$6.P11 | v61.21,18.8 61.21,14.99 v60.71,14.48
N$43  (via drill 0.61)
  Top 0.254: v42.42,20.32 42.42,21.08 44.2,22.86 45.72,22.86 45.97,22.61 45.97,21.08 U$1.9
  Bottom 0.254: v42.42,20.32 42.16,20.57 40.89,20.57 Q3.1
N$44  (via drill 0.61)
  Top 0.254: v45.97,18.03 44.96,19.05 44.96,20.83 U$1.10
  Bottom 0.254: v45.97,18.03 45.47,18.54 45.47,21.84 41.91,25.4 38.61,25.4 36.32,23.11 36.32,22.61 36.83,22.1 36.83,19.81 38.35,18.29 38.35,17.53 39.12,16.76 40.64,16.76 Q4.1
N$45  (via drill 0.61)
  Top 0.254: v42.93,22.86 43.43,22.86 43.94,23.37 44.7,23.37 v45.21,23.88 | v56.64,28.19 56.64,27.69 v58.93,25.4
  Route15 0.254: 60.2,21.08 v60.2,23.62 58.93,24.89 v58.93,25.4
  Bottom 0.254: Q4.3 44.7,17.78 44.96,18.03 44.96,21.34 44.7,21.59 Q3.3 42.93,21.59 v42.93,22.86 | U$6.P$17 58.17,23.62 v60.2,23.62 62.23,21.59 62.23,17.02 64.01,15.24 C5.1 | v45.21,23.88 45.47,23.88 47.24,25.65 47.24,25.91 48.01,26.67 52.32,26.67 52.83,27.18 53.85,27.18 54.86,28.19 v56.64,28.19
N$46
  Top 0.254: R4.1 30.99,10.16 30.99,9.4 28.96,7.37 28.96,5.08 28.7,4.83 27.94,4.83 LTX.A
N$47
  Top 0.254: R5.1 38.86,21.59 38.86,19.05 L5V.A
N$48
  Top 0.254: R6.1 39.37,26.16 37.85,26.16 37.59,26.42 36.83,26.42 LEXE.A
N$49
  Top 0.254: R6.2 39.37,24.64 40.39,24.64 40.64,24.38 40.64,16.26 40.89,16 42.42,16 U$1.16
VCC  (via drill 0.61)
  Top 0.254: U$2.P$4 28.96,12.45 28.96,10.16 C3.1 | 37.34,22.35 v37.34,22.86 | 37.34,22.35 37.34,21.59 R5.2 | v33.02,22.35 37.34,22.35 | v48.26,30.23 46.48,30.23 IC1.1
  Bottom 0.254: v37.34,22.86 37.34,20.07 38.61,18.8 40.64,18.8 Q4.2
  pour Route15: 25.4,31.75 25.4,0 67.31,0 67.31,2.54 33.02,2.54 33.02,31.75
  pour Route15: 33.02,31.75 33.02,29.21 60.96,29.21 60.96,2.54 67.31,2.54 67.31,31.75
  pour Route15: 25.4,2.54 25.4,0 67.31,0 67.31,2.54
VDD  (via drill 0.61)  (2 unrouted)
  Top 0.254: U$1.18 42.42,14.48 41.15,14.48 U$4.20 40.89,14.48 39.12,14.48 39.12,14.99 | 39.12,14.99 39.12,16.51 C6.1 | 59.18,13.21 v59.18,13.97 | 59.18,13.21 59.18,12.7 R1.2 59.18,13.21 | v41.66,24.38 43.18,24.38 C1.1 | 65.53,13.21 65.79,13.46 65.79,15.24 C4.1 65.53,15.24 67.31,17.02 67.31,22.1 66.04,23.37 SV1.6 | 65.53,13.21 59.18,13.21 | v49.28,11.43 49.53,11.43 49.78,11.18 49.78,9.65 U$1.30 | v46.74,19.05 46.74,20.83 U$1.8 | v55.88,16.51 55.37,16 54.1,16 U$1.40 | v48.26,25.65 46.48,25.65 IC1.3 | SV2.6 66.04,7.11 67.31,8.38 67.31,11.94 66.04,13.21 65.53,13.21 | v38.86,14.99 39.12,14.99
  Route15 0.254: 49.78,11.43 49.78,12.7 48.26,14.22
  Bottom 0.254: v59.18,21.84 58.17,21.84 U$6.P$20 | v52.32,23.37 52.58,23.11 53.59,23.11 U$6.P8 | v49.28,11.43 49.53,11.68 51.05,11.68 IC2.8 | U$5.P$3 v48.26,17.78 | v49.53,23.11 U$5.P$7 49.53,20.07 49.78,19.81 50.55,19.81 50.8,20.07 U$5.P$8 | v38.86,22.86 39.12,22.61 40.64,22.61 Q3.2 | U$3.P$1 34.04,23.88 v34.29,23.62
  pour Route15: 34.29,27.94 34.29,3.81 59.69,3.81 59.69,27.94
VSS  (via drill 0.61)
  Top 0.254: 30.48,2.79 32.77,2.79 35.05,5.08 35.05,8.38 U$4.10 | 27.94,2.79 30.48,2.79 | 30.48,2.79 LRX.C | 37.08,16.51 37.08,19.05 L5V.C | U$1.5 49.02,21.08 48.26,21.08 U$1.6 48.26,20.83 v48.26,19.05 | v52.58,30.48 52.58,27.94 IC1.4 | v35.31,24.38 36.83,24.38 LEXE.C | U$2.P$3 26.92,12.45 26.92,10.16 C3.2 | v41.66,26.42 43.18,26.42 C1.2 | v63.75,16.76 63.75,15.24 C4.2 | v45.47,4.83 45.47,6.35 46.23,7.11 46.74,7.11 47.5,7.87 47.5,9.4 U$1.27 | v44.96,15.49 44.7,15.24 42.67,15.24 U$1.17 | v56.9,15.49 56.64,15.24 54.1,15.24 U$1.39 | IC1.2 v48.26,27.94 | v37.08,14.99 37.08,16.51 | 37.08,16.51 C6.2 | v26.42,2.79 27.94,2.79 | 27.94,2.79 LTX.C
  Bottom 0.254: IC2.1 45.21,11.68 44.2,11.68 43.94,11.94 43.94,12.19 44.2,12.45 45.21,12.45 IC2.2 45.47,12.45 46.48,12.45 46.74,12.7 46.48,12.95 45.47,12.95 IC2.3 45.21,12.95 44.2,12.95 43.94,13.21 43.94,13.46 44.2,13.72 45.21,13.72 IC2.4 45.47,13.72 46.99,13.72 | 46.99,13.72 47.5,13.72 48.77,12.45 51.05,12.45 IC2.7 | 46.99,13.72 U$5.P$4 46.99,18.03 48.01,19.05 v48.26,19.05 | v52.32,24.64 53.34,23.62 53.59,23.62 U$6.P9 | v30.23,6.35 30.23,3.81 C7.2 | v32.77,18.8 34.29,18.8 C8.2 | v65.79,16.76 65.79,15.24 C5.2 | v26.92,16.26 U$3.P$4 | v54.36,9.65 54.36,7.62 X1.GND
  pour Route2: 25.4,31.75 25.4,1.27 67.31,1.27 67.31,31.75